# Altium schematic sheet 07_eMMC.SchDoc
size 420 x 297 mm; SheetNumber: 13; SheetTotal: 29
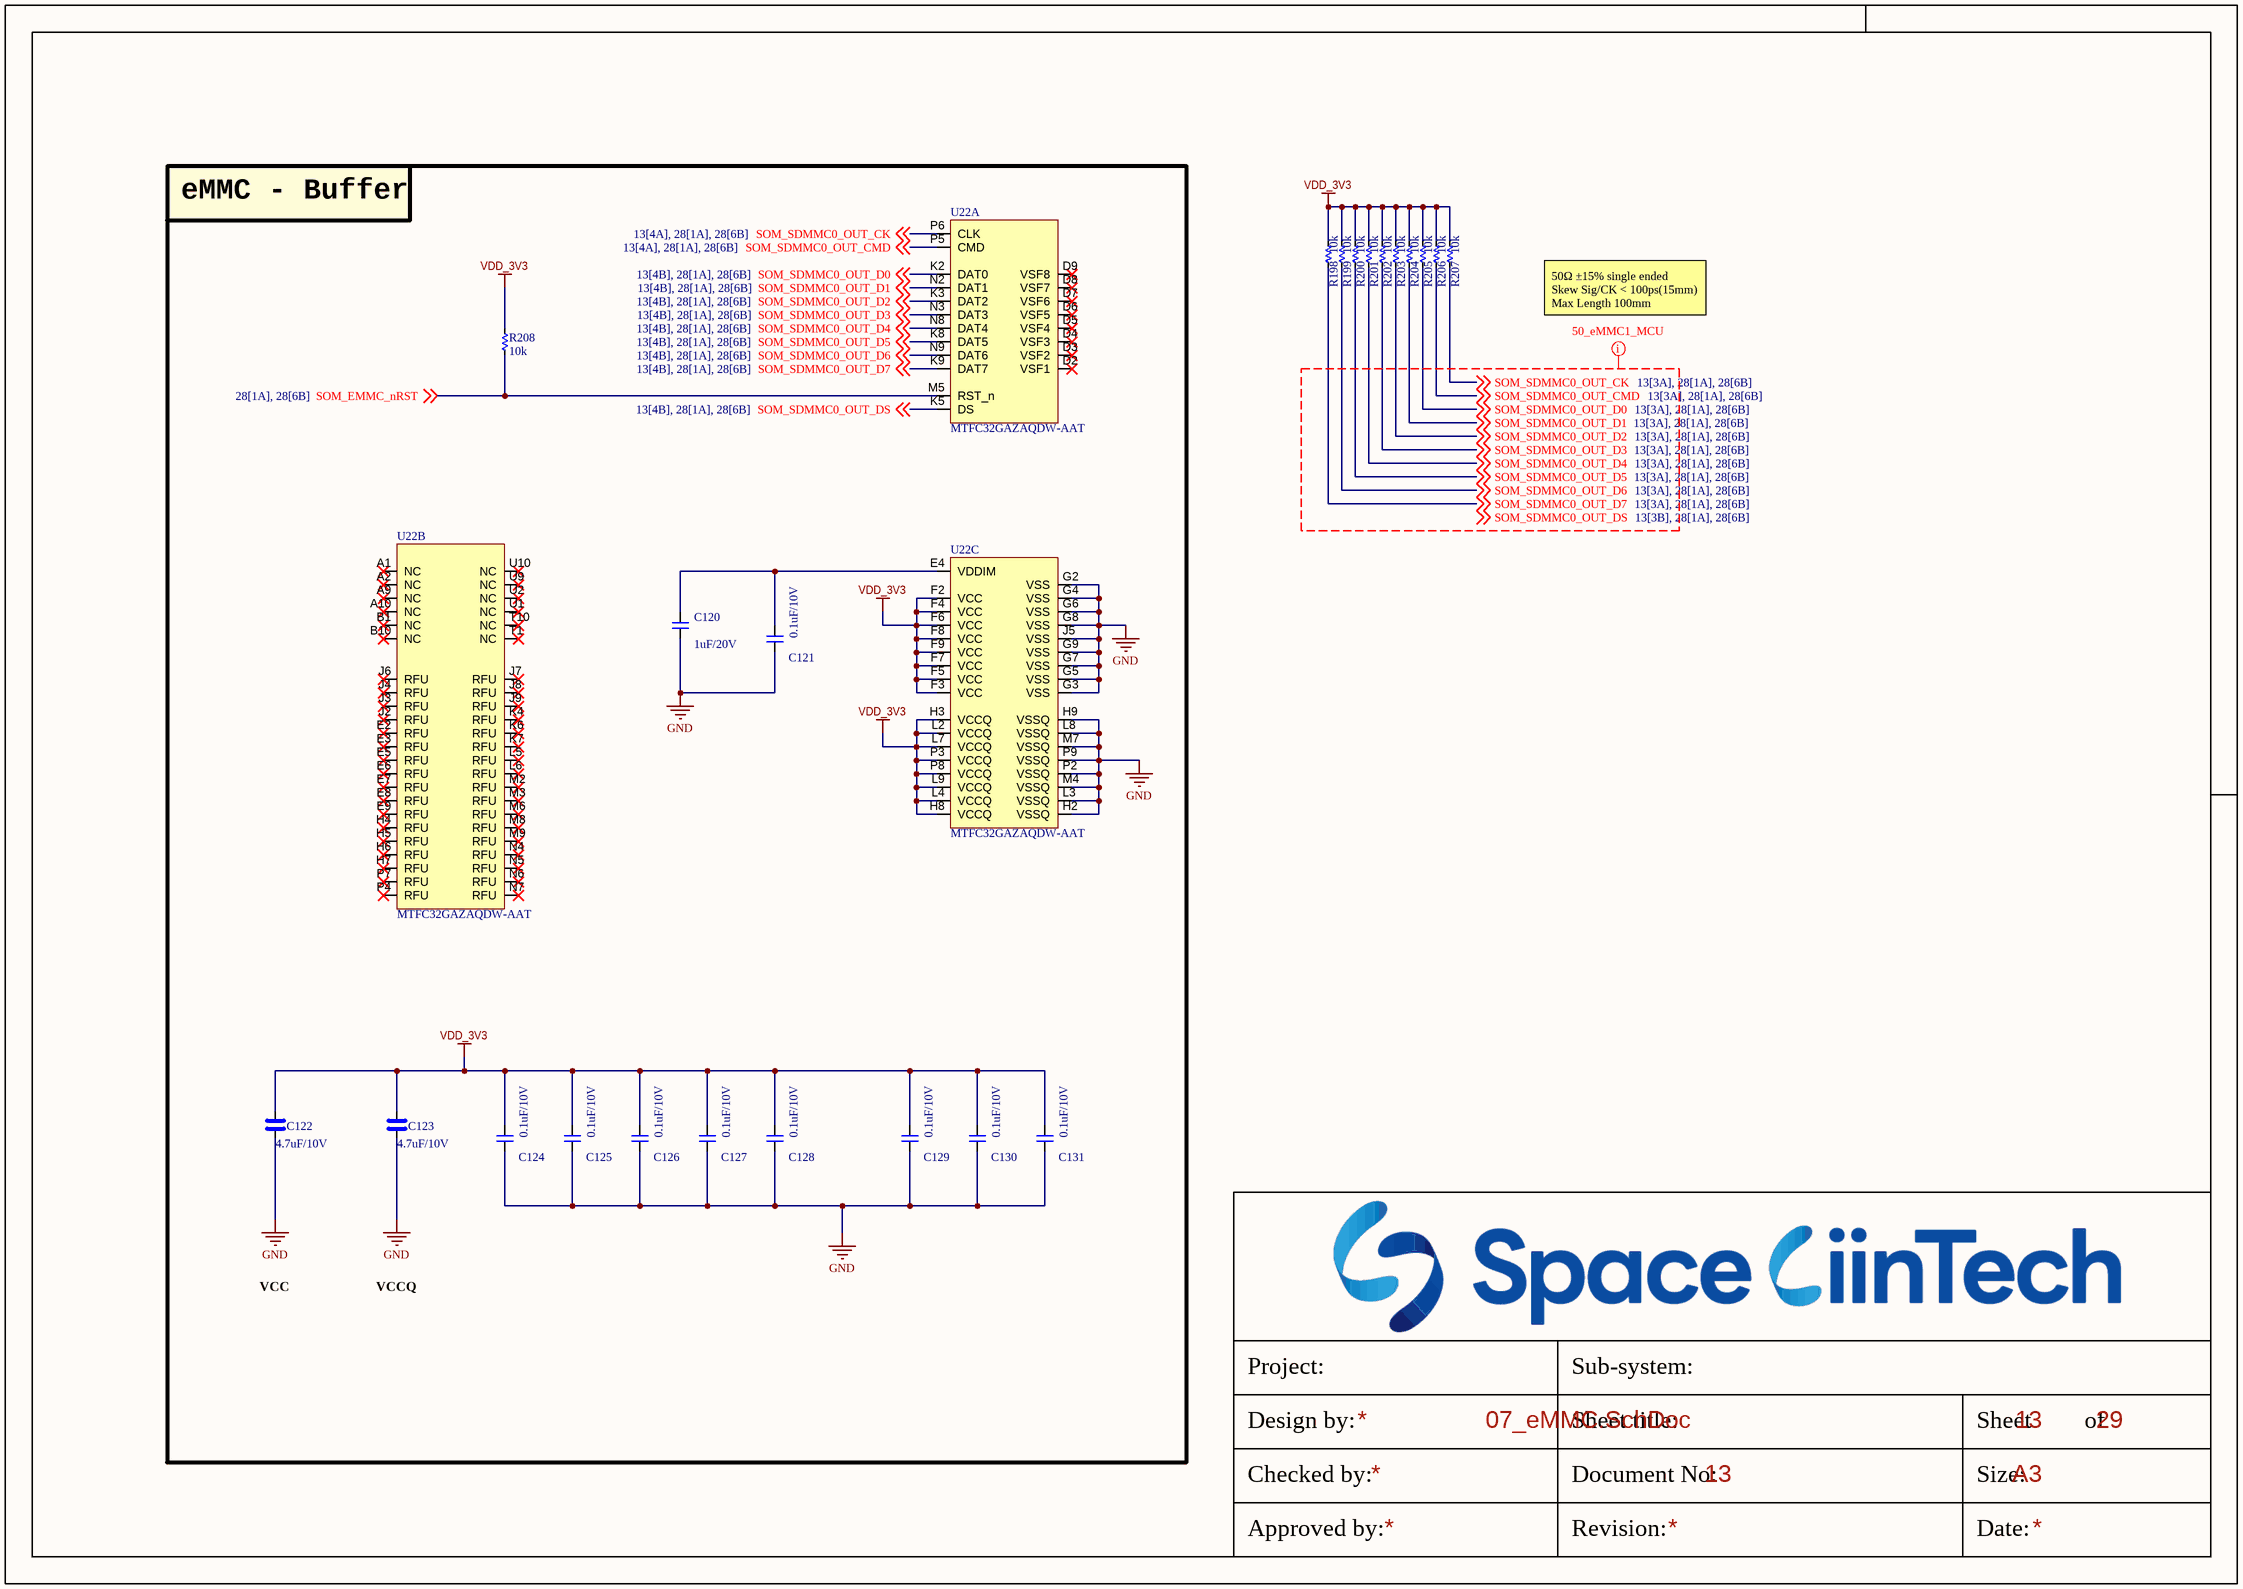
[diagram p0: 07_eMMC.SchDoc]

## Parts
C120  1uF/20V  [CAP_C_1005X60]
C121  0.1uF/10V  [CAP_C_1005X60]
C122  4.7uF/10V  [CAP_C_1005X60]
C123  4.7uF/10V  [CAP_C_1005X60]
C124  0.1uF/10V  [CAP_C_1005X60]
C125  0.1uF/10V  [CAP_C_1005X60]
C126  0.1uF/10V  [CAP_C_1005X60]
C127  0.1uF/10V  [CAP_C_1005X60]
C128  0.1uF/10V  [CAP_C_1005X60]
C129  0.1uF/10V  [CAP_C_1005X60]
C130  0.1uF/10V  [CAP_C_1005X60]
C131  0.1uF/10V  [CAP_C_1005X60]
R198  10k  [RES_C_1005X40]
R199  10k  [RES_C_1005X40]
R200  10k  [RES_C_1005X40]
R201  10k  [RES_C_1005X40]
R202  10k  [RES_C_1005X40]
R203  10k  [RES_C_1005X40]
R204  10k  [RES_C_1005X40]
R205  10k  [RES_C_1005X40]
R206  10k  [RES_C_1005X40]
R207  10k  [RES_C_1005X40]
R208  10k  [RES_C_1005X40]
U22  MTFC32GAZAQDW-AAT  [BGA_100_C_100P_10X17_1400X1800X150]  (parts A,B,C of 3)

## Blocks framed on the sheet
eMMC - Buffer: C120-C131 R208 U22

## Nets
GND: C120.1 C121.1 C122.1 C123.1 C124.1 C125.1 C126.1 C127.1 C128.1 C129.1 C130.1 C131.1 U22.G2(VSS) U22.G3(VSS) U22.G4(VSS) U22.G5(VSS) U22.G6(VSS) U22.G7(VSS) U22.G8(VSS) U22.G9(VSS) U22.H2(VSSQ) U22.H9(VSSQ) U22.J5(VSS) U22.L3(VSSQ) U22.L8(VSSQ) U22.M4(VSSQ) U22.M7(VSSQ) U22.P2(VSSQ) U22.P9(VSSQ)
VDD_3V3: C122.2 C123.2 C124.2 C125.2 C126.2 C127.2 C128.2 C129.2 C130.2 C131.2 R198.2 R199.2 R200.2 R201.2 R202.2 R203.2 R204.2 R205.2 R206.2 R207.2 R208.2 U22.F2(VCC) U22.F3(VCC) U22.F4(VCC) U22.F5(VCC) U22.F6(VCC) U22.F7(VCC) U22.F8(VCC) U22.F9(VCC) U22.H3(VCCQ) U22.H8(VCCQ) U22.L2(VCCQ) U22.L4(VCCQ) U22.L7(VCCQ) U22.L9(VCCQ) U22.P3(VCCQ) U22.P8(VCCQ)
SOM_EMMC_nRST: R208.1 U22.M5(RST_n) ; off-sheet SOM_EMMC_nRST
SOM_SDMMC0_OUT_CK: R207.1 U22.P6(CLK) ; off-sheet SOM_SDMMC0_OUT_CK
SOM_SDMMC0_OUT_CMD: R206.1 U22.P5(CMD) ; off-sheet SOM_SDMMC0_OUT_CMD
SOM_SDMMC0_OUT_D0: R205.1 U22.K2(DAT0) ; off-sheet SOM_SDMMC0_OUT_D0
SOM_SDMMC0_OUT_D1: R204.1 U22.N2(DAT1) ; off-sheet SOM_SDMMC0_OUT_D1
SOM_SDMMC0_OUT_D2: R203.1 U22.K3(DAT2) ; off-sheet SOM_SDMMC0_OUT_D2
SOM_SDMMC0_OUT_D3: R202.1 U22.N3(DAT3) ; off-sheet SOM_SDMMC0_OUT_D3
SOM_SDMMC0_OUT_D4: R201.1 U22.N8(DAT4) ; off-sheet SOM_SDMMC0_OUT_D4
SOM_SDMMC0_OUT_D5: R200.1 U22.K8(DAT5) ; off-sheet SOM_SDMMC0_OUT_D5
SOM_SDMMC0_OUT_D6: R199.1 U22.N9(DAT6) ; off-sheet SOM_SDMMC0_OUT_D6
SOM_SDMMC0_OUT_D7: R198.1 U22.K9(DAT7) ; off-sheet SOM_SDMMC0_OUT_D7
SOM_SDMMC0_OUT_DS: U22.K5(DS) ; off-sheet SOM_SDMMC0_OUT_DS
NetC120_2: C120.2 C121.2 U22.E4(VDDIM)

Not connected (* = marked no-connect by the designer): U22 A1(NC)* A2(NC)* A9(NC)* A10(NC)* B1(NC)* B10(NC)* D2(VSF1)* D3(VSF2)* D4(VSF3)* D5(VSF4)* D6(VSF5)* D7(VSF6)* D8(VSF7)* D9(VSF8)* E2(RFU)* E3(RFU)* E5(RFU)* E6(RFU)* E7(RFU)* E8(RFU)* E9(RFU)* H4(RFU)* H5(RFU)* H6(RFU)* H7(RFU)* J2(RFU)* J3(RFU)* J4(RFU)* J6(RFU)* J7(RFU)* J8(RFU)* J9(RFU)* K4(RFU)* K6(RFU)* K7(RFU)* L5(RFU)* L6(RFU)* M2(RFU)* M3(RFU)* M6(RFU)* M8(RFU)* M9(RFU)* N4(RFU)* N5(RFU)* N6(RFU)* N7(RFU)* P4(RFU)* P7(RFU)* T1(NC)* T10(NC)* U1(NC)* U2(NC)* U9(NC)* U10(NC)*

## Layout directives
net class 50_eMMC1_MCU: SOM_SDMMC0_OUT_CK, SOM_SDMMC0_OUT_CMD, SOM_SDMMC0_OUT_D0, SOM_SDMMC0_OUT_D1, SOM_SDMMC0_OUT_D2, SOM_SDMMC0_OUT_D3, SOM_SDMMC0_OUT_D4, SOM_SDMMC0_OUT_D5, SOM_SDMMC0_OUT_D6, SOM_SDMMC0_OUT_D7, SOM_SDMMC0_OUT_DS

## Notes on the sheet
- 50Ω ±15% single ended
  Skew Sig/CK < 100ps(15mm)
  Max Length 100mm
- VCC
- VCCQ
- Labels drawn without touching a wire or pin: SOM_SDMMC0_OUT_DS
- Project:
- Sub-system:
- Design by:
- Sheet title:
- Sheet
- of
- Checked by:
- Approved by:
- Revision:
- Document No:
- Size:
- Date:
- A3

## Library data of the parts
C120 C121 C124-C131 = _CAP_C_2: CAP CHIP
C122 C123 = _CAP_C_High_2: CAP CHIP High Value
R198-R208 = _RES_B_2: RES